# Altium project TSAL_Control_Alex_Sanchez&Arnau_Reina.PrjPcb
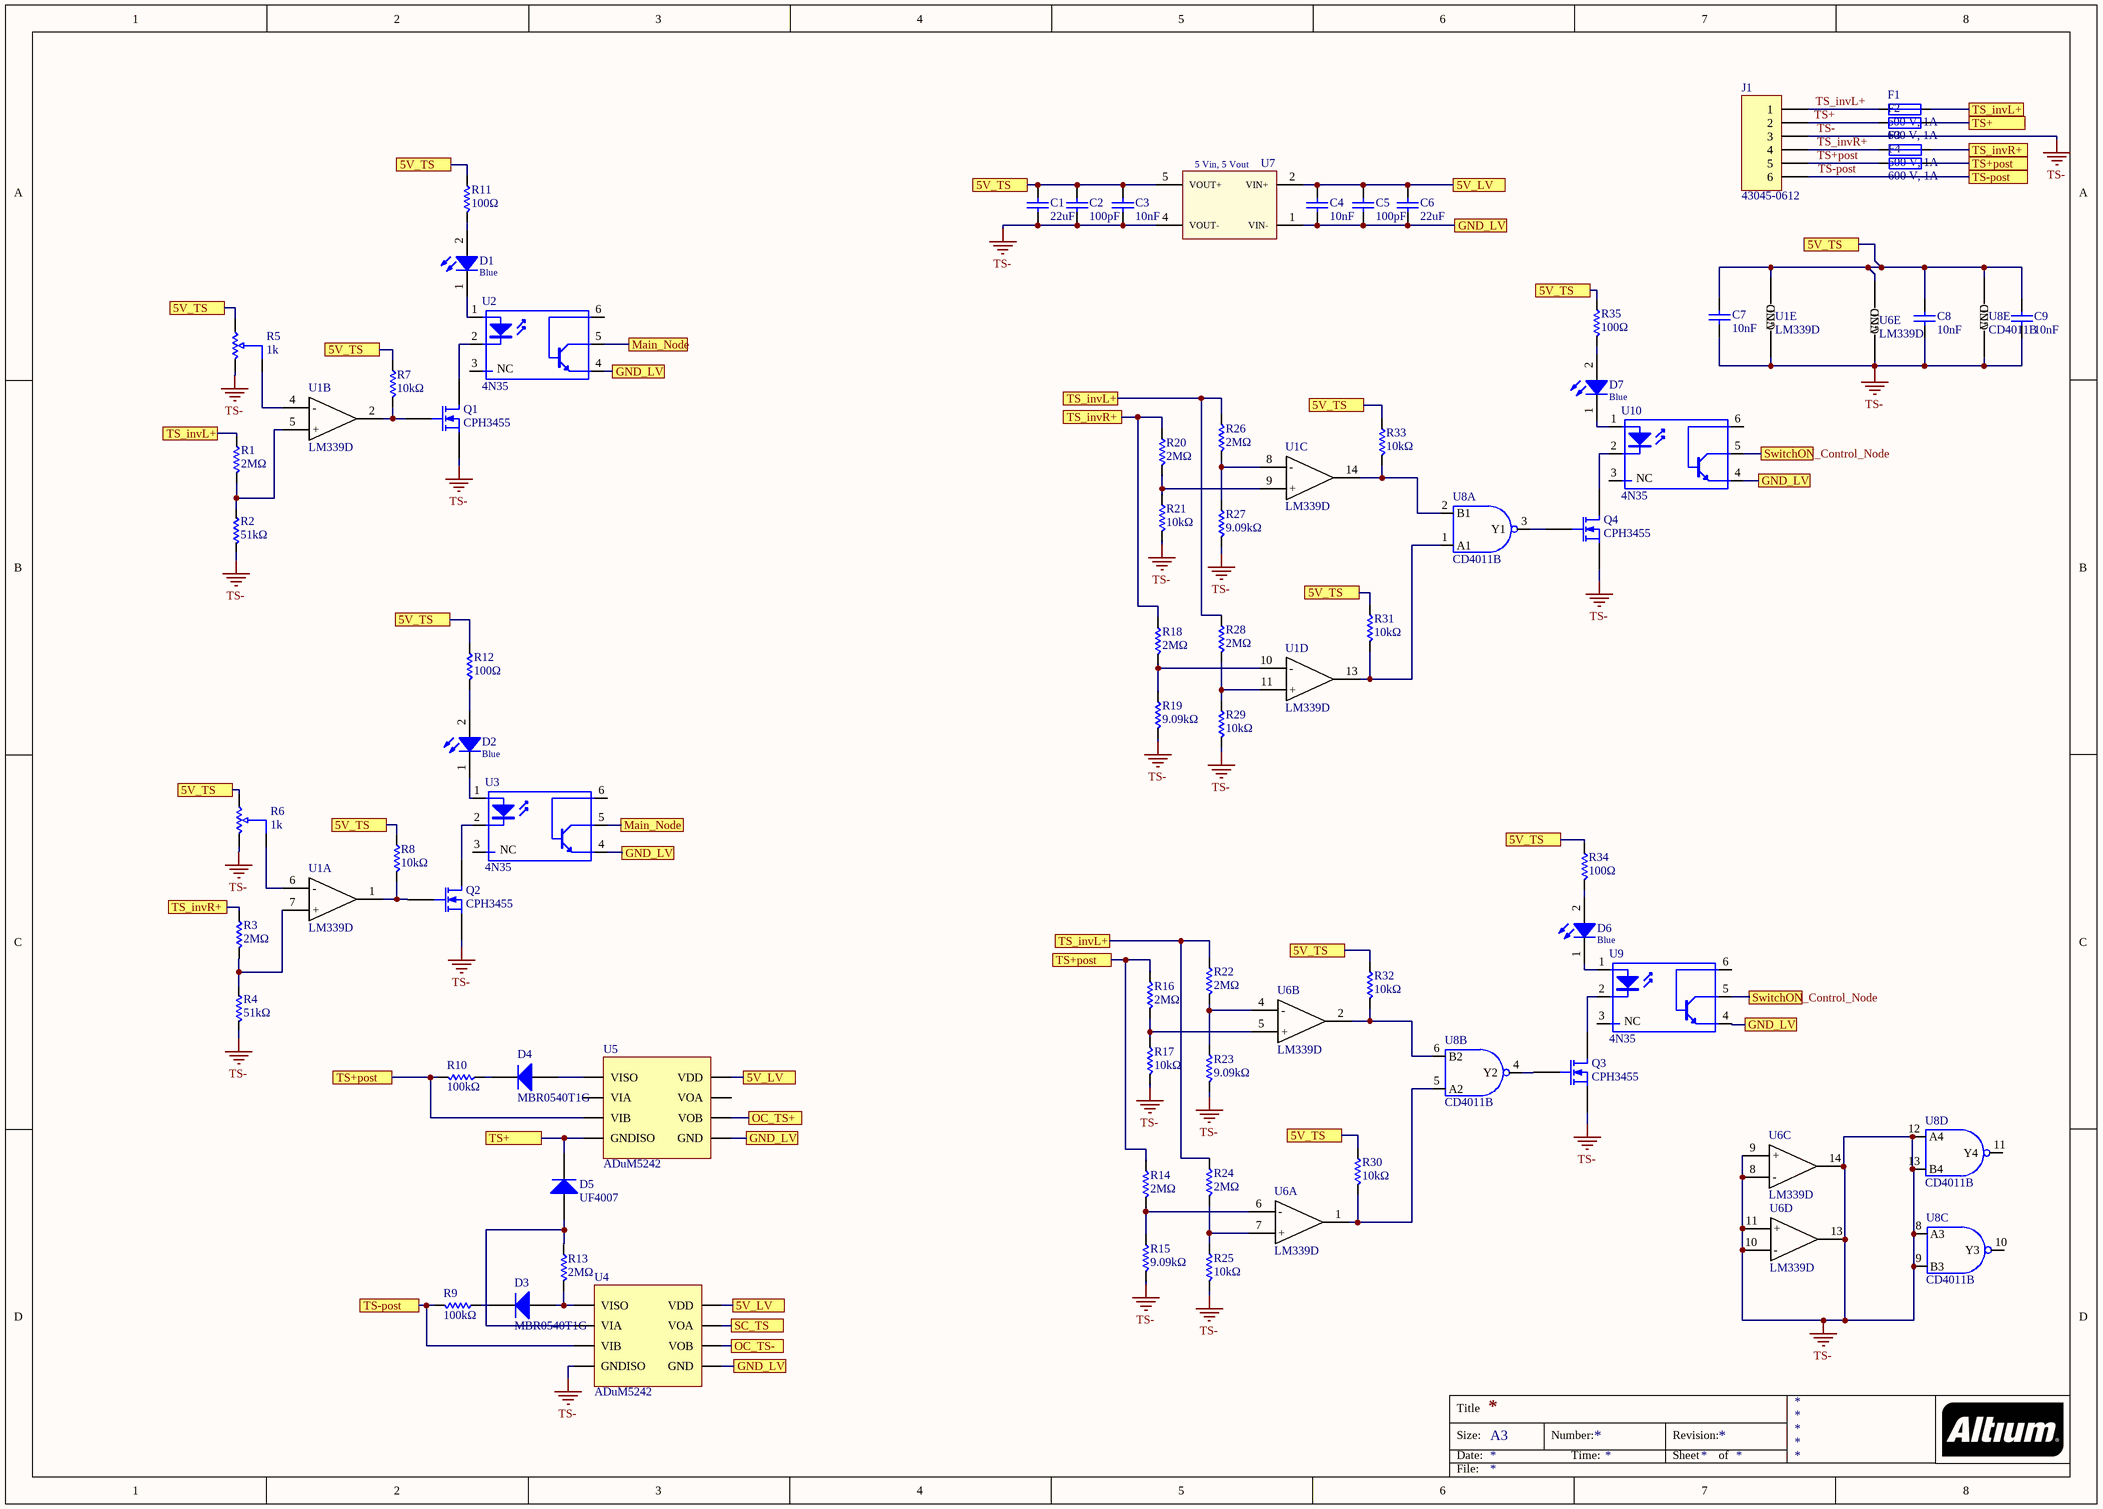
[diagram p0: TS.SchDoc]
3 sheets, 155 parts. Net scope: flat (ports and power ports of the same name join across sheets).
Board file: TSAL_Control.PcbDoc
Sheets:
  TS.SchDoc
  Signal_generator.SchDoc
  Control.SchDoc

## Sheet TS.SchDoc
size A3

### Parts
C1  22uF  [0805_2x1.25x1.25mm_Reflow Soldering]
C2  100pF  [0805_2x1.25x0.6mm_Reflow Soldering]
C3  10nF  [0805_2x1.25x0.8mm_Reflow Soldering]
C4  10nF  [0805_2x1.25x0.8mm_Reflow Soldering]
C5  100pF  [0805_2x1.25x0.6mm_Reflow Soldering]
C6  22uF  [0805_2x1.25x1.25mm_Reflow Soldering]
C7  10nF  [0805_2x1.25x0.8mm_Reflow Soldering]
C8  10nF  [0805_2x1.25x0.8mm_Reflow Soldering]
C9  10nF  [0805_2x1.25x0.8mm_Reflow Soldering]
D1  Blue  [WL-SMCW_0805]
D2  Blue  [WL-SMCW_0805]
D3  MBR0540T1G  [MBR0540T1G]
D4  MBR0540T1G  [MBR0540T1G]
D5  UF4007  [UF4007]
D6  Blue  [WL-SMCW_0805]
D7  Blue  [WL-SMCW_0805]
F1  600 V, 1A  [485001]
F2  600 V, 1A  [485001]
F3  600 V, 1A  [485001]
F4  600 V, 1A  [485001]
J1  43045-0612  [43045-0612]
Q1  CPH3455  [CPH3455]
Q2  CPH3455  [CPH3455]
Q3  CPH3455  [CPH3455]
Q4  CPH3455  [CPH3455]
R1  2MΩ  [CRMA2512]
R2  51kΩ  [1206]
R3  2MΩ  [CRMA2512]
R4  51kΩ  [1206]
R5  1k  [3296Y-1-102LF]
R6  1k  [3296Y-1-102LF]
R7  10kΩ  [CR0805]
R8  10kΩ  [CR0805]
R9  100kΩ  [1206]
R10  100kΩ  [1206]
R11  100Ω  [CR0805]
R12  100Ω  [CR0805]
R13  2MΩ  [CRMA2512]
R14  2MΩ  [CRMA2512]
R15  9.09kΩ  [1206]
R16  2MΩ  [CRMA2512]
R17  10kΩ  [1206]
R18  2MΩ  [CRMA2512]
R19  9.09kΩ  [1206]
R20  2MΩ  [CRMA2512]
R21  10kΩ  [1206]
R22  2MΩ  [CRMA2512]
R23  9.09kΩ  [1206]
R24  2MΩ  [CRMA2512]
R25  10kΩ  [1206]
R26  2MΩ  [CRMA2512]
R27  9.09kΩ  [1206]
R28  2MΩ  [CRMA2512]
R29  10kΩ  [1206]
R30  10kΩ  [CR0805]
R31  10kΩ  [CR0805]
R32  10kΩ  [CR0805]
R33  10kΩ  [CR0805]
R34  100Ω  [CR0805]
R35  100Ω  [CR0805]
U1  LM339D  [LM339D]  (parts A,B,C,D,E of 5)
U2  4N35  [4N35]
U3  4N35  [4N35]
U4  ADuM5242  [ADuM5242]
U5  ADuM5242  [ADuM5242]
U6  LM339D  [LM339D]  (parts A,B,C,D,E of 5)
U7  5 Vin, 5 Vout  [MagI³C-FISM_SMT-8]
U8  CD4011B  [CD4011BM]  (parts A,B,C,D,E of 5)
U9  4N35  [4N35]
U10  4N35  [4N35]

### Ports
5V_LV, 5V_TS, GND_LV, Main_Node, OC_TS+, OC_TS-, SC_TS, SwitchON_Control_Node, TS+, TS+post, TS-post, TS_invL+, TS_invR+

### Nets
TS-: C1.1 C2.1 C3.1 C7.1 C8.1 C9.1 J1.3 Q1.3(S) Q2.3(S) Q3.3(S) Q4.3(S) R2.1 R4.1 R5.3 R6.3 R15.1 R17.1 R19.1 R21.1 R23.1 R25.1 R27.1 R29.1 U1.12(GND) U4.5(GNDISO) U6.8(-) U6.9(+) U6.10(-) U6.11(+) U6.12(GND) U6.13(4OUT) U6.14(3OUT) U7.4(VOUT-) U8.7(GND) U8.8(A3) U8.9(B3) U8.12(A4) U8.13(B4)
TS+: F2.1 J1.2
TS+post: F4.1 J1.5
TS-post: J1.6 R9.1 U4.6(VIB) ; port TS-post
TS_invL+: F1.1 J1.1
TS_invR+: F3.1 J1.4
NetC1_2: C1.2 C2.2 C3.2 C7.2 C8.2 C9.2 R5.1 R6.1 R7.2 R8.2 R11.2 R12.2 R30.2 R31.2 R32.2 R33.2 R34.2 R35.2 U1.3(VCC) U6.3(VCC) U7.5(VOUT+) U8.14(VCC) ; port 5V_TS
NetC4_1: C4.1 C5.1 C6.1 U2.4(E) U3.4(E) U4.4(GND) U5.4(GND) U7.1(VIN-) U9.4(E) U10.4(E) ; port GND_LV
NetC4_2: C4.2 C5.2 C6.2 U4.1(VDD) U5.1(VDD) U7.2(VIN+) ; port 5V_LV
NetD1_1: D1.1(K) U2.1(A)
NetD1_2: D1.2(A) R11.1
NetD2_1: D2.1(K) U3.1(A)
NetD2_2: D2.2(A) R12.1
NetD3_1: D3.1(K) R9.2
NetD3_2: D3.2(A) R13.1 U4.8(VISO)
NetD4_1: D4.1(K) R10.2
NetD4_2: D4.2(A) U5.8(VISO)
NetD5_1: D5.1(K) F2.2 U5.5(GNDISO) ; port TS+
NetD5_2: D5.2(A) R13.2 U4.7(VIA)
NetD6_1: D6.1(K) U9.1(A)
NetD6_2: D6.2(A) R34.1
NetD7_1: D7.1(K) U10.1(A)
NetD7_2: D7.2(A) R35.1
NetF1_2: F1.2 R1.2 R22.2 R24.2 R26.2 R28.2 ; port TS_invL+
NetF3_2: F3.2 R3.2 R18.2 R20.2 ; port TS_invR+
NetF4_2: F4.2 R10.1 R14.2 R16.2 U5.6(VIB) ; port TS+post
NetQ1_1: Q1.1(G) R7.1 U1.2(2OUT)
NetQ1_2: Q1.2(D) U2.2(K)
NetQ2_1: Q2.1(G) R8.1 U1.1(1OUT)
NetQ2_2: Q2.2(D) U3.2(K)
NetQ3_1: Q3.1(G) U8.4(Y2)
NetQ3_2: Q3.2(D) U9.2(K)
NetQ4_1: Q4.1(G) U8.3(Y1)
NetQ4_2: Q4.2(D) U10.2(K)
NetQ6_1: U9.5(C) U10.5(C) ; port SwitchON_Control_Node
NetQ7_1: U2.5(C) U3.5(C) ; port Main_Node
NetQ22_1: U5.3(VOB) ; port OC_TS+
NetQ25_1: U4.2(VOA) ; port SC_TS
NetQ31_1: U4.3(VOB) ; port OC_TS-
NetR1_1: R1.1 R2.2 U1.5(+)
NetR3_1: R3.1 R4.2 U1.7(+)
NetR5_2: R5.2 U1.4(-)
NetR6_2: R6.2 U1.6(-)
NetR14_1: R14.1 R15.2 U6.6(-)
NetR16_1: R16.1 R17.2 U6.5(+)
NetR18_1: R18.1 R19.2 U1.10(-)
NetR20_1: R20.1 R21.2 U1.9(+)
NetR22_1: R22.1 R23.2 U6.4(-)
NetR24_1: R24.1 R25.2 U6.7(+)
NetR26_1: R26.1 R27.2 U1.8(-)
NetR28_1: R28.1 R29.2 U1.11(+)
NetR30_1: R30.1 U6.1(1OUT) U8.5(A2)
NetR31_1: R31.1 U1.13(4OUT) U8.1(A1)
NetR32_1: R32.1 U6.2(2OUT) U8.6(B2)
NetR33_1: R33.1 U1.14(3OUT) U8.2(B1)

Not connected (* = marked no-connect by the designer): U2 3 6; U3 3 6; U5 2(VOA) 7(VIA); U8 10(Y3) 11(Y4); U9 3 6; U10 3 6

### Notes on the sheet
- Title
- Size:
- Date:
- A3
- Number:
- Time:
- Revision:
- Sheet
- of
- File:
- (in symbol 4N35) NC

### Library data of the parts
C1 C6 = 885012107011: WCAP-CSGP Ceramic Capacitors, 0805, X5R, 10V, 22uF; Rated Voltage: 10V DC; ComponentLink1Description: Manufacturer; ComponentLink1URL: http://www.we-online.de; ComponentLink2Description: Datasheet; ComponentLink2URL: http://katalog.we-online.de/pbs/datasheet/885012107011.pdf; Part Number: 885012107011; Published Date: Oct. 2017; Publisher: Wurth Elektronik; Size: 0805; Operating Temperature: -55 °C to +125 °C; Value: 22uF; Ceramic Type: X5R
C2 C5 = 885012007057: WCAP-CSGP Ceramic Capacitors, 0805, NP0, 50V, 100pF; Rated Voltage: 50V DC; ComponentLink1Description: Manufacturer; ComponentLink1URL: http://www.we-online.de; ComponentLink2Description: Datasheet; ComponentLink2URL: http://katalog.we-online.de/pbs/datasheet/885012007057.pdf; Part Number: 885012007057; Published Date: Oct. 2017; Publisher: Wurth Elektronik; Size: 0805; Operating Temperature: -55 °C to +125 °C; Value: 100pF; Ceramic Type: NP0
C3 C4 C7-C9 = 885012207092: WCAP-CSGP Ceramic Capacitors, 0805, X7R, 50V, 10nF; Rated Voltage: 50V DC; ComponentLink1Description: Manufacturer; ComponentLink1URL: http://www.we-online.de; ComponentLink2Description: Datasheet; ComponentLink2URL: http://katalog.we-online.de/pbs/datasheet/885012207092.pdf; Part Number: 885012207092; Published Date: Oct. 2017; Publisher: Wurth Elektronik; Size: 0805; Operating Temperature: -55 °C to +125 °C; Value: 10nF; Ceramic Type: X7R
D1 D2 D6 D7 = 150080BS75000: SMT Mono-color Chip LED Waterclear WL-SMCW, size 0805, Blue, 3.2 V, 140 deg, 145 mcd; Forward Voltage: 3.2 V; Viewing Angle: 140 deg; Peak Wavelength: 465 nm; Dominant Wavelength: 470 nm; Luminous Intensity: 145 mcd; Chip Technology: InGaN; ComponentLink1Description: Manufacturer; ComponentLink1URL: http://www.we-online.de; ComponentLink2Description: Datasheet; ComponentLink2URL: https://katalog.we-online.de/led/datasheet/150080BS75000.pdf; Part Number: 150080BS75000; Published Date: November 2018; Publisher: Wurth Elektronik; Size: 0805; Operating Temperature: -40 to 85 degC; Emitting Color: Blue; Mounting Technology: SMT; Packaging: Tape and Reel
D3 D4 = MBR0540T1G: Surface Mount / Schottky Power Rectifier; Manufacturer: ON Semiconductor; ComponentLink1Description: Datasheet; ComponentLink1URL: https://www.onsemi.com/pub/Collateral/MBR0540T1-D.PDF
D5 = UF4007: Ultrafast Plastic Rectifier; Manufacturer: Vishay; ComponentLink1Description: Datasheet; ComponentLink1URL: https://www.vishay.com/docs/88755/uf4001.pdf
F1-F4 = 485001: 485 Series Fuse; Manufacturer: Littlefuse; ComponentLink1Description: Datasheet; ComponentLink1URL: https://www.littelfuse.com/~/media/electronics/datasheets/fuses/littelfuse_fuse_485_datasheet.pdf.pdf; ComponentLink2Description: Manufacturer; ComponentLink2URL: https://www.littelfuse.com/
J1 = 43045-0612: Micro-Fit Vertical Header, Through Hole, 3mm Pitch, Dual Row, 6 Circuits; Manufacturer: Molex; Rated Voltage: 600V DC; Rated Current: 8.5A; Operating Temperature: -40ºC to +105ºC; ComponentLink1Description: Manufacturer; ComponentLink1URL: https://www.molex.com/molex/home; ComponentLink2Description: Datasheet; ComponentLink2URL: https://www.molex.com/pdm_docs/sd/430450612_sd.pdf
Q1-Q4 = CPH3455: Power MOSFET, 35V, 104 mohm, 3A, Single N-Channel; Manufacturer: ON Semiconductor; ComponentLink1Description: Datasheet; ComponentLink1URL: https://www.onsemi.com/pub/Collateral/CPH3455-D.PDF
R1 R3 R13 R14 R16 R18 R20 R22 R24 R26 R28 = CRMA2512AF2M00FKEF: Chip Resistor 2512, 1415V; Manufacturer: Vishay; ComponentLink1Description: Datasheet; ComponentLink1URL: https://www.mouser.es/datasheet/2/427/crma-1152212.pdf
R2 R4 = ERJP08F5102V: Chip Resistor 1206; Manufacturer: Panasonic; ComponentLink1Description: Datasheet; ComponentLink1URL: https://docs-emea.rs-online.com/webdocs/12cb/0900766b812cb812.pdf
R5 R6 = 3296Y-1-102LF: Potentiometer. 1/2W, 1k; Manufacturer: Bourns; ComponentLink1Description: Datasheet; ComponentLink1URL: https://docs-emea.rs-online.com/webdocs/069c/0900766b8069ccf4.pdf
R7 R8 R30-R33 = CR0805-JW-103ELF: Chip Resistor 0805; Manufacturer: Bourns; ComponentLink1Description: Datasheet; ComponentLink1URL: https://www.bourns.com/docs/product-datasheets/chpreztr.pdf?sfvrsn=566c91f1_11
R9 R10 = CR1206-FX-1003ELF: Chip Resistor 1206; Manufacturer: Bourns; ComponentLink1Description: Datasheet; ComponentLink1URL: https://docs-emea.rs-online.com/webdocs/1273/0900766b812730af.pdf
R11 R12 R34 R35 = CR0805-FX-1000ELF: Chip Resistor 0805; Manufacturer: Bourns; ComponentLink1Description: Datasheet; ComponentLink1URL: https://www.bourns.com/docs/product-datasheets/chpreztr.pdf?sfvrsn=566c91f1_11
R15 R19 R23 R27 = CRCW12069K09FKEA: Chip Resistor 1206; Manufacturer: Vishay; ComponentLink1Description: Datasheet; ComponentLink1URL: https://docs-emea.rs-online.com/webdocs/0d98/0900766b80d98b5e.pdf
R17 R21 R25 R29 = CR1206-JW-103GLF: Chip Resistor 1206; Manufacturer: Bourns; ComponentLink1Description: Datasheet; ComponentLink1URL: https://docs-emea.rs-online.com/webdocs/13ed/0900766b813ed02b.pdf
U1 U6 = LM339D: Quad Differential Comparators; Manufacturer: Texas Intstruments; ComponentLink1Description: Datasheet; ComponentLink1URL: http://www.ti.com/lit/ds/symlink/lm339.pdf
U2 U3 U9 U10 = 4N35: General Purpose 6-Pin Phototransistor Optocouplers; Manufacturer: ON Semiconductor/Fairchild; ComponentLink1Description: Datasheet; ComponentLink1URL: https://docs-emea.rs-online.com/webdocs/12cf/0900766b812cf004.pdf
U4 U5 = ADuM5242: Dual-Channel Isolator with isoPower Integrated DC-to-DC Converter; Manufacturer: Analog Devices; ComponentLink1Description: Datasheet; ComponentLink1URL: https://www.analog.com/media/en/technical-documentation/data-sheets/adum5240_5241_5242.pdf
U7 = 176920512: MagI³C-FISM Fixed Isolated Module, SMT-8, 5 Vin, 5 Vout; Output Voltage: 5 V; Output Power: 1 W; ComponentLink1Description: Manufacturer; ComponentLink1URL: http://www.we-online.de; ComponentLink2Description: Datasheet; ComponentLink2URL: https://katalog.we-online.de/pm/datasheet/176920512.pdf; Part Number: 176920512; Published Date: August 2018; Publisher: Wurth Elektronik; Size: SMT-8; Input Voltage: 5 V; Mounting Technology: SMT; Operating Temperature: -40 to 100 degC; Packaging: Tape and Reel
U8 = CD4011B: QUAD CMOS NAND GATES; Manufacturer: Texas Instruments; ComponentLink1Description: Datasheet; ComponentLink1URL: http://www.ti.com/lit/gpn/cd4011b

## Sheet Signal_generator.SchDoc
size A3
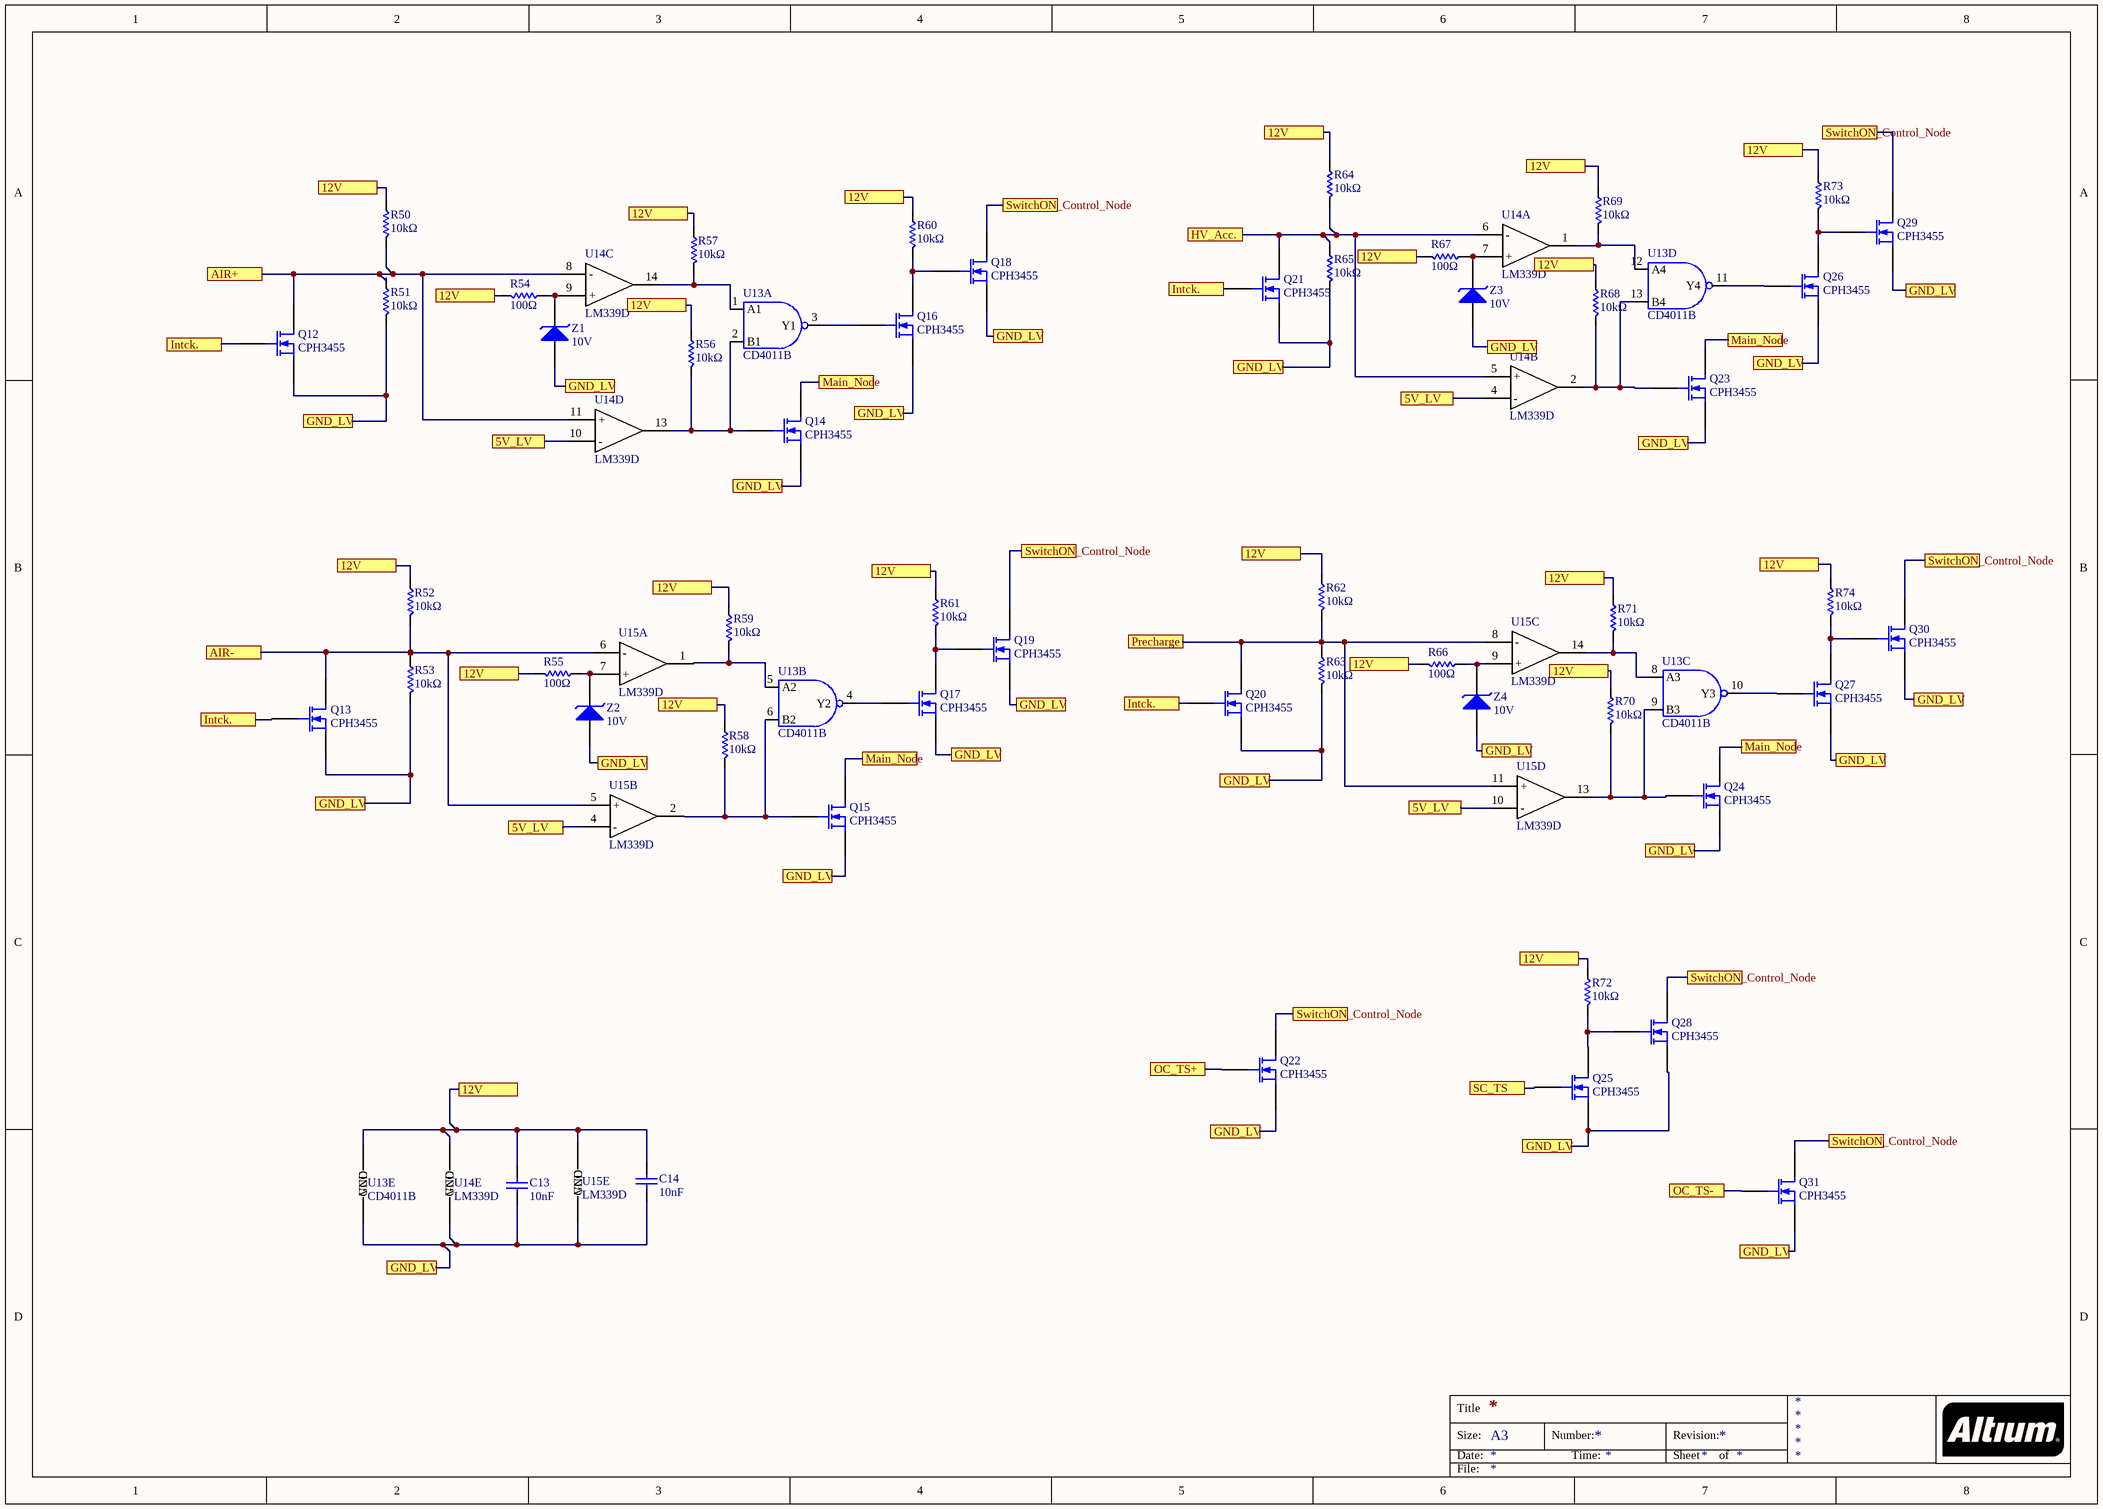
[diagram p1: Signal_generator.SchDoc]

### Parts
C13  10nF  [0805_2x1.25x0.8mm_Reflow Soldering]
C14  10nF  [0805_2x1.25x0.8mm_Reflow Soldering]
Q12  CPH3455  [CPH3455]
Q13  CPH3455  [CPH3455]
Q14  CPH3455  [CPH3455]
Q15  CPH3455  [CPH3455]
Q16  CPH3455  [CPH3455]
Q17  CPH3455  [CPH3455]
Q18  CPH3455  [CPH3455]
Q19  CPH3455  [CPH3455]
Q20  CPH3455  [CPH3455]
Q21  CPH3455  [CPH3455]
Q22  CPH3455  [CPH3455]
Q23  CPH3455  [CPH3455]
Q24  CPH3455  [CPH3455]
Q25  CPH3455  [CPH3455]
Q26  CPH3455  [CPH3455]
Q27  CPH3455  [CPH3455]
Q28  CPH3455  [CPH3455]
Q29  CPH3455  [CPH3455]
Q30  CPH3455  [CPH3455]
Q31  CPH3455  [CPH3455]
R50  10kΩ  [CR0805]
R51  10kΩ  [CR0805]
R52  10kΩ  [CR0805]
R53  10kΩ  [CR0805]
R54  100Ω  [CR0805]
R55  100Ω  [CR0805]
R56  10kΩ  [CR0805]
R57  10kΩ  [CR0805]
R58  10kΩ  [CR0805]
R59  10kΩ  [CR0805]
R60  10kΩ  [CR0805]
R61  10kΩ  [CR0805]
R62  10kΩ  [CR0805]
R63  10kΩ  [CR0805]
R64  10kΩ  [CR0805]
R65  10kΩ  [CR0805]
R66  100Ω  [CR0805]
R67  100Ω  [CR0805]
R68  10kΩ  [CR0805]
R69  10kΩ  [CR0805]
R70  10kΩ  [CR0805]
R71  10kΩ  [CR0805]
R72  10kΩ  [CR0805]
R73  10kΩ  [CR0805]
R74  10kΩ  [CR0805]
U13  CD4011B  [CD4011BM]  (parts A,B,C,D,E of 5)
U14  LM339D  [LM339D]  (parts A,B,C,D,E of 5)
U15  LM339D  [LM339D]  (parts A,B,C,D,E of 5)
Z1  10V  [MMSZ5240BT1G]
Z2  10V  [MMSZ5240BT1G]
Z3  10V  [MMSZ5240BT1G]
Z4  10V  [MMSZ5240BT1G]

### Ports
5V_LV, 12V, AIR+, AIR-, GND_LV, HV_Acc., Intck., Main_Node, OC_TS+, OC_TS-, Precharge, SC_TS, SwitchON_Control_Node

### Nets
NetC4_1: C13.1 C14.1 Q12.3(S) Q13.3(S) Q14.3(S) Q15.3(S) Q16.3(S) Q17.3(S) Q18.3(S) Q19.3(S) Q20.3(S) Q21.3(S) Q22.3(S) Q23.3(S) Q24.3(S) Q25.3(S) Q26.3(S) Q27.3(S) Q28.3(S) Q29.3(S) Q30.3(S) Q31.3(S) R51.1 R53.1 R63.1 R65.1 U13.7(GND) U14.12(GND) U15.12(GND) Z1.2(A) Z2.2(A) Z3.2(A) Z4.2(A) ; port GND_LV
NetC4_2: U14.4(-) U14.10(-) U15.4(-) U15.10(-) ; port 5V_LV
NetC13_2: C13.2 C14.2 R50.2 R52.2 R54.1 R55.1 R56.2 R57.2 R58.2 R59.2 R60.2 R61.2 R62.2 R64.2 R66.1 R67.1 R68.2 R69.2 R70.2 R71.2 R72.2 R73.2 R74.2 U13.14(VCC) U14.3(VCC) U15.3(VCC) ; port 12V
NetJ2_3: Q12.1(G) Q13.1(G) Q20.1(G) Q21.1(G) ; port Intck.
NetJ2_4: Q12.2(D) R50.1 R51.2 U14.8(-) U14.11(+) ; port AIR+
NetJ2_5: Q13.2(D) R52.1 R53.2 U15.5(+) U15.6(-) ; port AIR-
NetJ2_6: Q20.2(D) R62.1 R63.2 U15.8(-) U15.11(+) ; port Precharge
NetJ2_7: Q21.2(D) R64.1 R65.2 U14.5(+) U14.6(-) ; port HV_Acc.
NetQ6_1: Q18.2(D) Q19.2(D) Q22.2(D) Q28.2(D) Q29.2(D) Q30.2(D) Q31.2(D) ; port SwitchON_Control_Node
NetQ7_1: Q14.2(D) Q15.2(D) Q23.2(D) Q24.2(D) ; port Main_Node
NetQ14_1: Q14.1(G) R56.1 U13.2(B1) U14.13(4OUT)
NetQ15_1: Q15.1(G) R58.1 U13.6(B2) U15.2(2OUT)
NetQ16_1: Q16.1(G) U13.3(Y1)
NetQ16_2: Q16.2(D) Q18.1(G) R60.1
NetQ17_1: Q17.1(G) U13.4(Y2)
NetQ17_2: Q17.2(D) Q19.1(G) R61.1
NetQ22_1: Q22.1(G) ; port OC_TS+
NetQ23_1: Q23.1(G) R68.1 U13.13(B4) U14.2(2OUT)
NetQ24_1: Q24.1(G) R70.1 U13.9(B3) U15.13(4OUT)
NetQ25_1: Q25.1(G) ; port SC_TS
NetQ25_2: Q25.2(D) Q28.1(G) R72.1
NetQ26_1: Q26.1(G) U13.11(Y4)
NetQ26_2: Q26.2(D) Q29.1(G) R73.1
NetQ27_1: Q27.1(G) U13.10(Y3)
NetQ27_2: Q27.2(D) Q30.1(G) R74.1
NetQ31_1: Q31.1(G) ; port OC_TS-
NetR54_2: R54.2 U14.9(+) Z1.1(K)
NetR55_2: R55.2 U15.7(+) Z2.1(K)
NetR57_1: R57.1 U13.1(A1) U14.14(3OUT)
NetR59_1: R59.1 U13.5(A2) U15.1(1OUT)
NetR66_2: R66.2 U15.9(+) Z4.1(K)
NetR67_2: R67.2 U14.7(+) Z3.1(K)
NetR69_1: R69.1 U13.12(A4) U14.1(1OUT)
NetR71_1: R71.1 U13.8(A3) U15.14(3OUT)

### Notes on the sheet
- Title
- Size:
- Date:
- A3
- Number:
- Time:
- Revision:
- Sheet
- of
- File:

### Library data of the parts
C13 C14 = 885012207092: as C3 on sheet TS; ComponentLink1Description: Manufacturer; ComponentLink1URL: http://www.we-online.de; ComponentLink2Description: Datasheet; ComponentLink2URL: http://katalog.we-online.de/pbs/datasheet/885012207092.pdf; Part Number: 885012207092; Published Date: Oct. 2017; Publisher: Wurth Elektronik; Size: 0805; Operating Temperature: -55 °C to +125 °C; Value: 10nF; Ceramic Type: X7R
Q12-Q31 = CPH3455: as Q1 on sheet TS; ComponentLink1Description: Datasheet; ComponentLink1URL: https://www.onsemi.com/pub/Collateral/CPH3455-D.PDF
R50-R53 R56-R65 R68-R74 = CR0805-JW-103ELF: Chip Resistor 0805; Manufacturer: Bourns; ComponentLink1Description: Datasheet; ComponentLink1URL: https://www.bourns.com/docs/product-datasheets/chpreztr.pdf?sfvrsn=566c91f1_11
R54 R55 R66 R67 = CR0805-FX-1000ELF: Chip Resistor 0805; Manufacturer: Bourns; ComponentLink1Description: Datasheet; ComponentLink1URL: https://www.bourns.com/docs/product-datasheets/chpreztr.pdf?sfvrsn=566c91f1_11
U13 = CD4011B: as U8 on sheet TS; ComponentLink1Description: Datasheet; ComponentLink1URL: http://www.ti.com/lit/gpn/cd4011b
U14 U15 = LM339D: as U1 on sheet TS; ComponentLink1Description: Datasheet; ComponentLink1URL: http://www.ti.com/lit/ds/symlink/lm339.pdf
Z1-Z4 = MMSZ5240BT1G: Zener Voltage Regulators; Manufacturer: ON Semiconductor; ComponentLink1Description: Datasheet; ComponentLink1URL: https://docs-emea.rs-online.com/webdocs/14af/0900766b814af7e2.pdf

## Sheet Control.SchDoc
size A4
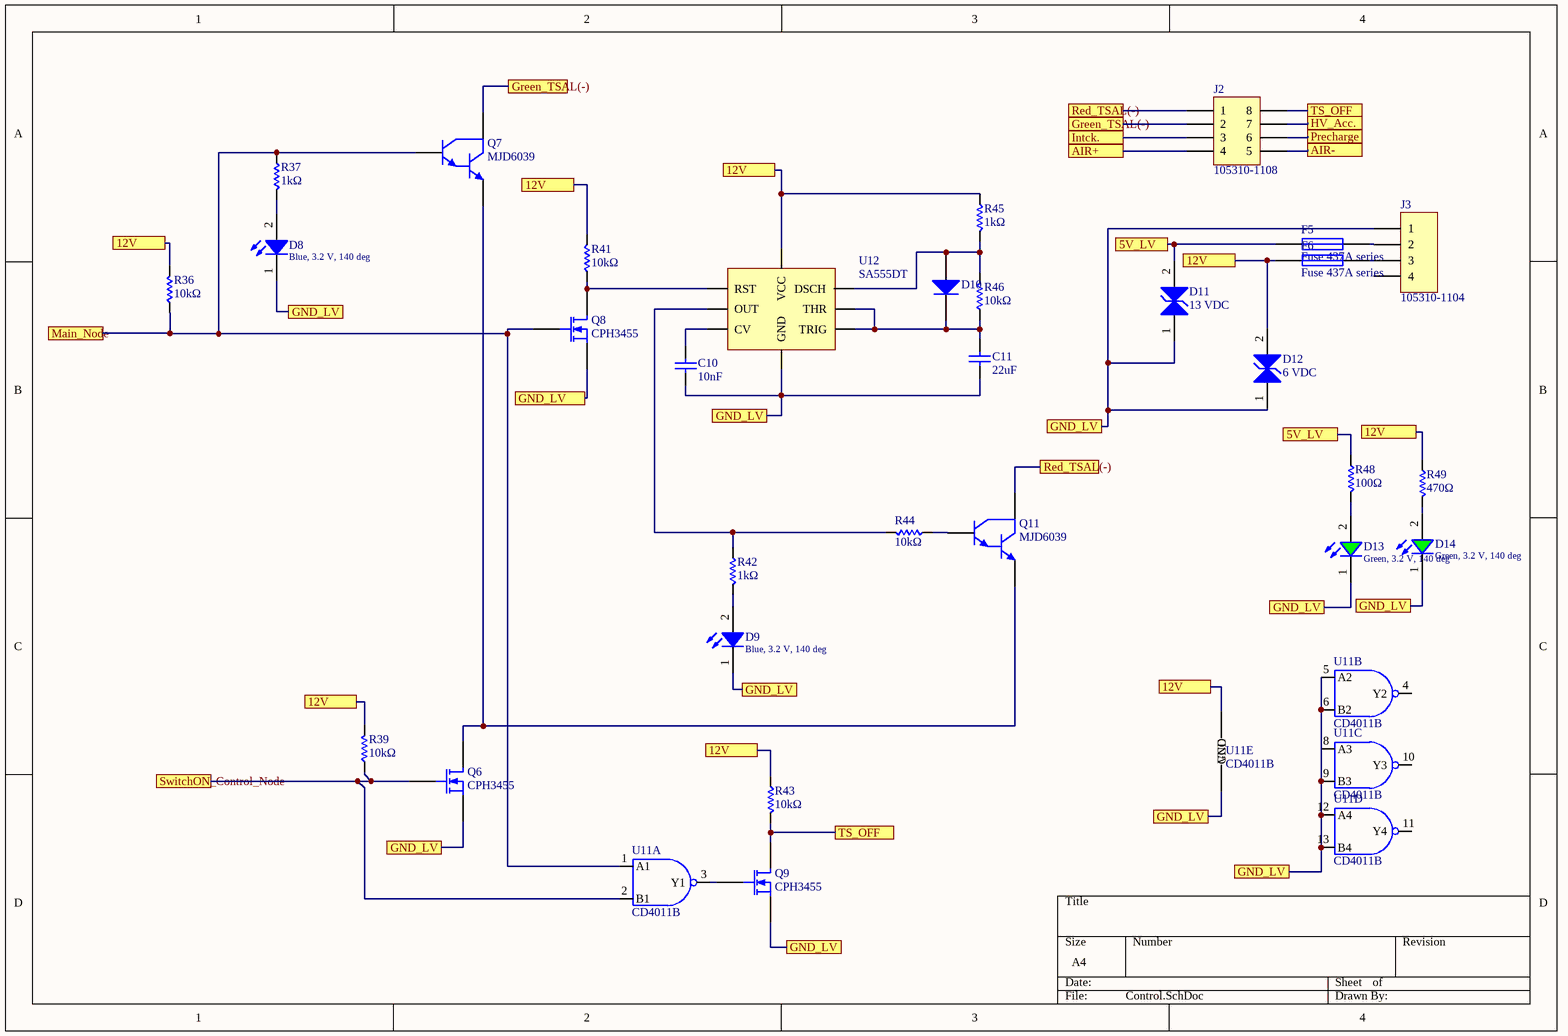
[diagram p2: Control.SchDoc]

### Parts
C10  10nF  [0805_2x1.25x0.8mm_Reflow Soldering]
C11  22uF  [0805_2x1.25x1.25mm_Reflow Soldering]
D8  Blue, 3.2 V, 140 deg  [WL-SMCW_0805]
D9  Blue, 3.2 V, 140 deg  [WL-SMCW_0805]
D10  (no value)  [MBR0540T1G]
D11  13 VDC  [WE-TVSP_DO-214AC_Bidirectional]
D12  6 VDC  [WE-TVSP_DO-214AC_Bidirectional]
D13  Green, 3.2 V, 140 deg  [WL-SMCW_0805]
D14  Green, 3.2 V, 140 deg  [WL-SMCW_0805]
F5  Fuse 437A series  [437A_Series]
F6  Fuse 437A series  [437A_Series]
J2  105310-1108  [105310-1108]
J3  105310-1104  [105310-1104]
Q6  CPH3455  [CPH3455]
Q7  MJD6039  [MJD6039]
Q8  CPH3455  [CPH3455]
Q9  CPH3455  [CPH3455]
Q11  MJD6039  [MJD6039]
R36  10kΩ  [CR0805]
R37  1kΩ  [CR0805]
R39  10kΩ  [CR0805]
R41  10kΩ  [CR0805]
R42  1kΩ  [CR0805]
R43  10kΩ  [CR0805]
R44  10kΩ  [CR0805]
R45  1kΩ  [CR0805]
R46  10kΩ  [CR0805]
R48  100Ω  [CR0805]
R49  470Ω  [CR0805]
U11  CD4011B  [CD4011BM]  (parts A,B,C,D,E of 5)
U12  SA555DT  [SA555DT]

### Ports
5V_LV, 12V, AIR+, AIR-, GND_LV, Green_TSAL(-), HV_Acc., Intck., Main_Node, Precharge, Red_TSAL(-), SwitchON_Control_Node, TS_OFF

### Nets
NetC4_1: C10.1 C11.1 D8.1(K) D9.1(K) D11.1(C) D12.1(C) D13.1(K) D14.1(K) J3.1 Q6.3(S) Q8.3(S) Q9.3(S) U11.5(A2) U11.6(B2) U11.7(GND) U11.8(A3) U11.9(B3) U11.12(A4) U11.13(B4) U12.1(GND) ; port GND_LV
NetC4_2: D11.2(C) F5.1 R48.2 ; port 5V_LV
NetC10_2: C10.2 U12.5(CV)
NetC11_2: C11.2 D10.1(K) R46.2 U12.2(TRIG) U12.6(THR)
NetC13_2: D12.2(C) F6.1 R36.1 R39.1 R41.1 R43.2 R45.2 R49.2 U11.14(VCC) U12.8(VCC) ; port 12V
NetD8_2: D8.2(A) R37.1
NetD9_2: D9.2(A) R42.1
NetD10_2: D10.2(A) R45.1 R46.1 U12.7(DSCH)
NetD13_2: D13.2(A) R48.1
NetD14_2: D14.2(A) R49.1
NetF5_2: F5.2 J3.2
NetF6_2: F6.2 J3.3
NetJ2_1: J2.1 Q11.2(C) ; port Red_TSAL(-)
NetJ2_2: J2.2 Q7.2(C) ; port Green_TSAL(-)
NetJ2_3: J2.3 ; port Intck.
NetJ2_4: J2.4 ; port AIR+
NetJ2_5: J2.5 ; port AIR-
NetJ2_6: J2.6 ; port Precharge
NetJ2_7: J2.7 ; port HV_Acc.
NetJ2_8: J2.8 Q9.2(D) R43.1 ; port TS_OFF
NetQ6_1: Q6.1(G) R39.2 U11.2(B1) ; port SwitchON_Control_Node
NetQ6_2: Q6.2(D) Q7.3(E) Q11.3(E)
NetQ7_1: Q7.1(B) Q8.1(G) R36.2 R37.2 U11.1(A1) ; port Main_Node
NetQ8_2: Q8.2(D) R41.2 U12.4(RST)
NetQ9_1: Q9.1(G) U11.3(Y1)
NetQ11_1: Q11.1(B) R44.2
NetR42_2: R42.2 R44.1 U12.3(OUT)

Not connected (* = marked no-connect by the designer): J3 4; U11 4(Y2) 10(Y3) 11(Y4)

### Library data of the parts
C10 = 885012207092: as C3 on sheet TS; ComponentLink1Description: Manufacturer; ComponentLink1URL: http://www.we-online.de; ComponentLink2Description: Datasheet; ComponentLink2URL: http://katalog.we-online.de/pbs/datasheet/885012207092.pdf; Part Number: 885012207092; Published Date: Oct. 2017; Publisher: Wurth Elektronik; Size: 0805; Operating Temperature: -55 °C to +125 °C; Value: 10nF; Ceramic Type: X7R
C11 = 885012107011: as C1 on sheet TS; ComponentLink1Description: Manufacturer; ComponentLink1URL: http://www.we-online.de; ComponentLink2Description: Datasheet; ComponentLink2URL: http://katalog.we-online.de/pbs/datasheet/885012107011.pdf; Part Number: 885012107011; Published Date: Oct. 2017; Publisher: Wurth Elektronik; Size: 0805; Operating Temperature: -55 °C to +125 °C; Value: 22uF; Ceramic Type: X5R
D8 D9 = 150080BS75000: as D1 on sheet TS; ComponentLink1Description: Manufacturer; ComponentLink1URL: http://www.we-online.de; ComponentLink2Description: Datasheet; ComponentLink2URL: https://katalog.we-online.de/led/datasheet/150080BS75000.pdf; Part Number: 150080BS75000; Published Date: November 2018; Publisher: Wurth Elektronik; Size: 0805; Operating Temperature: -40 to 85 degC; Emitting Color: Blue; Mounting Technology: SMT; Packaging: Tape and Reel
D10 = MBR0540T1G: as D3 on sheet TS; ComponentLink1Description: Datasheet; ComponentLink1URL: https://www.onsemi.com/pub/Collateral/MBR0540T1-D.PDF
D11 = 824501131: WE-TVSP Power TVS Diode, size DO-214AC, Bidirectional, 400 W, 13 VDC; Peak Pulse Current: 18.6 A; Power Dissipation: 400 W; Reverse Breakdown Voltage: 15.15 V; Reverse Stand-Off Voltage: 13 V; Surge Clamping Voltage: 21.5 V; ComponentLink1Description: Manufacturer; ComponentLink1URL: http://www.we-online.de; ComponentLink2Description: Datasheet; ComponentLink2URL: https://katalog.we-online.de/pbs/datasheet/824501131.pdf; Part Number: 824501131; Published Date: September 2018; Publisher: Wurth Elektronik; Size: DO-214AC; Operating Temperature: -65 to 150 degC; Mounting Technology: SMT; Packaging: Tape and Reel; Polarity: Bidirectional
D12 = 824501600: WE-TVSP Power TVS Diode, size DO-214AC, Bidirectional, 400 W, 6 VDC; Peak Pulse Current: 38.8 A; Power Dissipation: 400 W; Reverse Breakdown Voltage: 7.02 V; Reverse Stand-Off Voltage: 6 V; Surge Clamping Voltage: 10.3 V; ComponentLink1Description: Manufacturer; ComponentLink1URL: http://www.we-online.de; ComponentLink2Description: Datasheet; ComponentLink2URL: https://katalog.we-online.de/pbs/datasheet/824501600.pdf; Part Number: 824501600; Published Date: September 2018; Publisher: Wurth Elektronik; Size: DO-214AC; Operating Temperature: -65 to 150 degC; Mounting Technology: SMT; Packaging: Tape and Reel; Polarity: Bidirectional
D13 D14 = 150080GS75000: SMT Mono-color Chip LED Waterclear WL-SMCW, size 0805, Green, 3.2 V, 140 deg, 450 mcd; Forward Voltage: 3.2 V; Viewing Angle: 140 deg; Peak Wavelength: 515 nm; Dominant Wavelength: 525 nm; Luminous Intensity: 450 mcd; Chip Technology: InGaN; ComponentLink1Description: Manufacturer; ComponentLink1URL: http://www.we-online.de; ComponentLink2Description: Datasheet; ComponentLink2URL: https://katalog.we-online.de/led/datasheet/150080GS75000.pdf; Part Number: 150080GS75000; Published Date: November 2018; Publisher: Wurth Elektronik; Size: 0805; Operating Temperature: -40 to 85 degC; Emitting Color: Green; Mounting Technology: SMT; Packaging: Tape and Reel
F5 F6 = Fuse 437A series: Fuse; Manufacturer: Littelfuse; ComponentLink1Description: Datasheet; ComponentLink1URL: https://www.littelfuse.com/~/media/electronics/datasheets/fuses/littelfuse_fuse_437a_datasheet.pdf.pdf
J2 = 105310-1108: Nano-Fit Vertical Header, Through Hole, 2.50mm Pitch, Dual Row, 8 Circuits; Manufacturer: Molex; ComponentLink1Description: Manufacturer; ComponentLink1URL: https://www.molex.com/molex/home; ComponentLink2Description: Datasheet; ComponentLink2URL: https://www.molex.com/pdm_docs/sd/1053101108_sd.pdf
J3 = 105310-1104: Nano-Fit Vertical Header, Through Hole, 2.50mm Pitch, Dual Row, 4 Circuits; Manufacturer: Molex; Rated Voltage: 250V DC; Rated Current: 6.5A; Operating Temperature: -40°C to +105°C; ComponentLink1Description: Manufacturer; ComponentLink1URL: https://www.molex.com/molex/home; ComponentLink2Description: Datasheet; ComponentLink2URL: https://www.molex.com/pdm_docs/sd/1053101104_sd.pdf
Q6 Q8 Q9 = CPH3455: as Q1 on sheet TS; ComponentLink1Description: Datasheet; ComponentLink1URL: https://www.onsemi.com/pub/Collateral/CPH3455-D.PDF
Q7 Q11 = MJD6039: Darlington Power / Transistors; Manufacturer: ON Semiconductor; VoltageRating_BE: *; TemperatureRange: *; ComponentLink1Description: Datasheet; ComponentLink1URL: https://www.onsemi.com/pub/Collateral/MJD6039-D.PDF
R36 R39 R41 R43 R44 R46 = CR0805-JW-103ELF: Chip Resistor 0805; Manufacturer: Bourns; ComponentLink1Description: Datasheet; ComponentLink1URL: https://www.bourns.com/docs/product-datasheets/chpreztr.pdf?sfvrsn=566c91f1_11
R37 R42 R45 = CR0805-JW-102ELF: Chip Resistor 0805; Manufacturer: Bourns; ComponentLink1Description: Datasheet; ComponentLink1URL: https://www.bourns.com/docs/product-datasheets/chpreztr.pdf?sfvrsn=566c91f1_11
R48 = CR0805-FX-1000ELF: Chip Resistor 0805; Manufacturer: Bourns; ComponentLink1Description: Datasheet; ComponentLink1URL: https://www.bourns.com/docs/product-datasheets/chpreztr.pdf?sfvrsn=566c91f1_11
R49 = CR0805-FX-4700GLF: Chip Resistor 0805; Manufacturer: Bourns; ComponentLink1Description: Datasheet; ComponentLink1URL: https://www.bourns.com/docs/product-datasheets/chpreztr.pdf?sfvrsn=566c91f1_11
U11 = CD4011B: as U8 on sheet TS; ComponentLink1Description: Datasheet; ComponentLink1URL: http://www.ti.com/lit/gpn/cd4011b
U12 = SA555DT: General Purpose Single Bipolar Timer; Manufacturer: ST Mircoelectronics; ComponentLink1Description: Datasheet; ComponentLink1URL: https://www.st.com/resource/en/datasheet/cd00000479.pdf

## Nets that join several sheets
NetC4_1: TS (10 pins), Signal_generator (33 pins), Control (20 pins)
NetC4_2: TS (6 pins), Signal_generator (U14.4 U14.10 U15.4 U15.10), Control (D11.2 F5.1 R48.2)
NetC13_2: Signal_generator (26 pins), Control (10 pins)
NetJ2_3: Signal_generator (Q12.1 Q13.1 Q20.1 Q21.1), Control (J2.3)
NetJ2_4: Signal_generator (5 pins), Control (J2.4)
NetJ2_5: Signal_generator (5 pins), Control (J2.5)
NetJ2_6: Signal_generator (5 pins), Control (J2.6)
NetJ2_7: Signal_generator (5 pins), Control (J2.7)
NetQ6_1: TS (U9.5 U10.5), Signal_generator (7 pins), Control (Q6.1 R39.2 U11.2)
NetQ7_1: TS (U2.5 U3.5), Signal_generator (Q14.2 Q15.2 Q23.2 Q24.2), Control (5 pins)
NetQ22_1: TS (U5.3), Signal_generator (Q22.1)
NetQ25_1: TS (U4.2), Signal_generator (Q25.1)
NetQ31_1: TS (U4.3), Signal_generator (Q31.1)